# EAGLE design 208_humidity_hts221 (EAGLE 9.6.2)
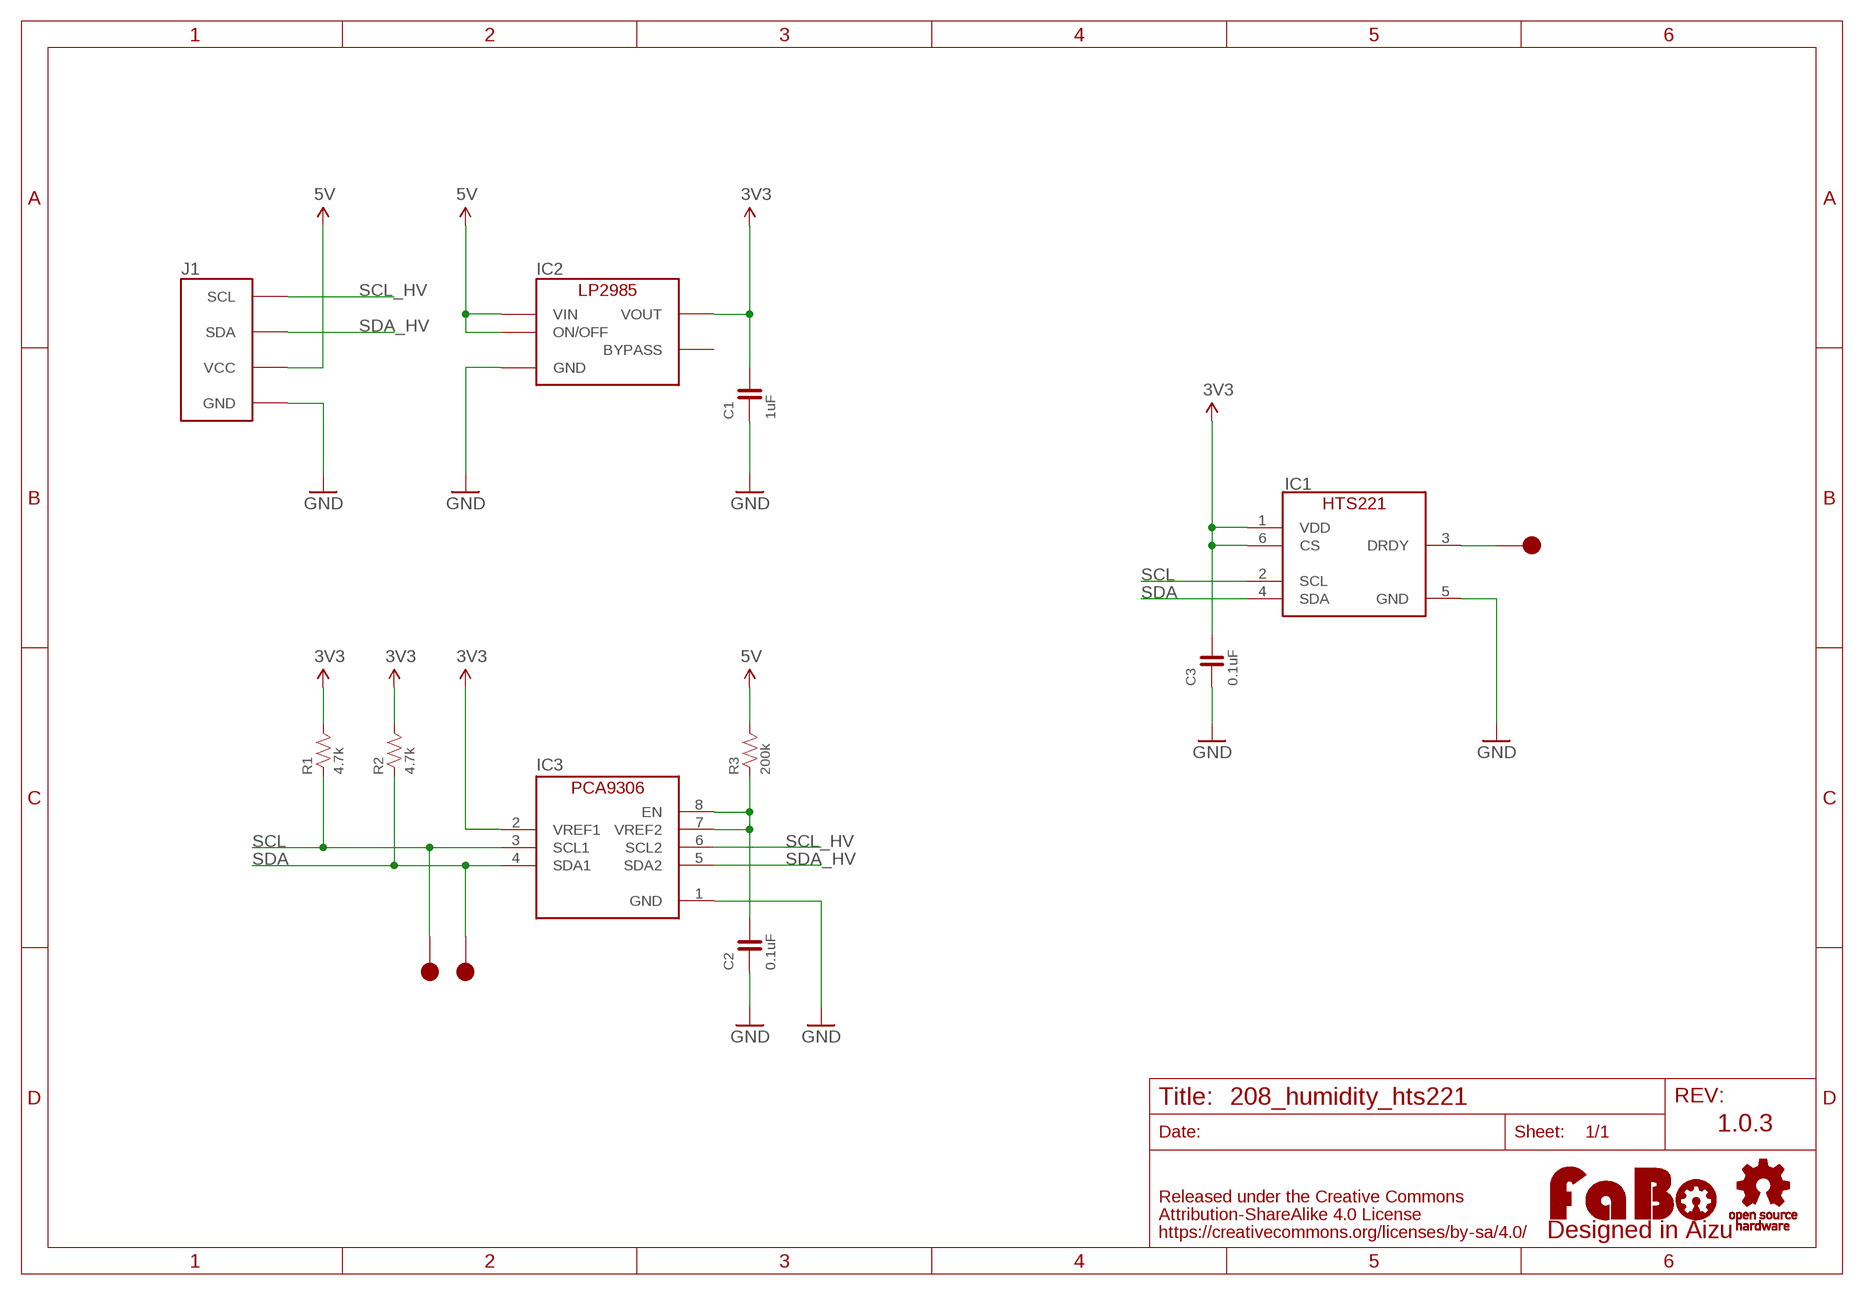
[diagram p0: schematic, sheet 1]

## Parts
C1  1uF  CAPACITOR-0603  [0603]
C2  0.1uF  CAPACITOR-0603  [0603]
C3  0.1uF  CAPACITOR-0603  [0603]
IC1  ST-HTS221  [ST-HTS221]
IC2  LP2985-33DBV  [SOT-23-5]
IC3  PCA9306GM  [XQFN8]
J1  FABO_BRICK_I2C  [FABO_BRICK_I2C]
LOGO1  LOGO_FABO-M  [LOGO_FABO_M]
R1  4.7k  RESISTOR-0603  [0603]
R2  4.7k  RESISTOR-0603  [0603]
R3  200k  RESISTOR-0603  [0603]
TP1  TP-15  [TP-15]
TP2  TP-15  [TP-15]
TP3  TP-15  [TP-15]
U$3  LOGO_OSHW-M_BOTTOM  [LOGO_OSHW_M_BOTTOM]

## Nets
3V3: C1.2 C3.2 IC1.1(VDD) IC1.6(CS) IC2.5(VOUT) IC3.2(VREF1) R1.2 R2.2
5V: IC2.1(VIN) IC2.3(ON/OFF) J1.VCC R3.2
GND: C1.1 C2.1 C3.1 IC1.5(GND) IC2.2(GND) IC3.1(GND) J1.GND
N$1: C2.2 IC3.7(VREF2) IC3.8(EN) R3.1
N$2: IC1.3(DRDY) TP3.1
SCL: IC1.2(SCL) IC3.3(SCL1) R1.1 TP2.1
SCL_HV: IC3.6(SCL2) J1.SCL
SDA: IC1.4(SDA) IC3.4(SDA1) R2.1 TP1.1
SDA_HV: IC3.5(SDA2) J1.SDA
Unconnected: IC2.4(BYPASS)

## Notes on the sheet
- 1.0.3

## Library data of the parts
C1-C3 = FaBo-Capacitor:CAPACITOR: CAPACITOR
IC1 = FaBo-Mems:ST-HTS221
IC2 = FaBo-Supply:LP2985: LP2985
IC3 = FaBo-LevelTranslator:PCA9306
J1 = FaBo-Template:FABO_BRICK_I2C: FaBo Brick I2C
LOGO1 = component:LOGO_FABO
R1-R3 = FaBo-Resistors:RESISTOR: RESISTOR
TP1-TP3 = FaBo-Supply:TP
U$3 = FaBo-etc:LOGO_OSHW

## Board
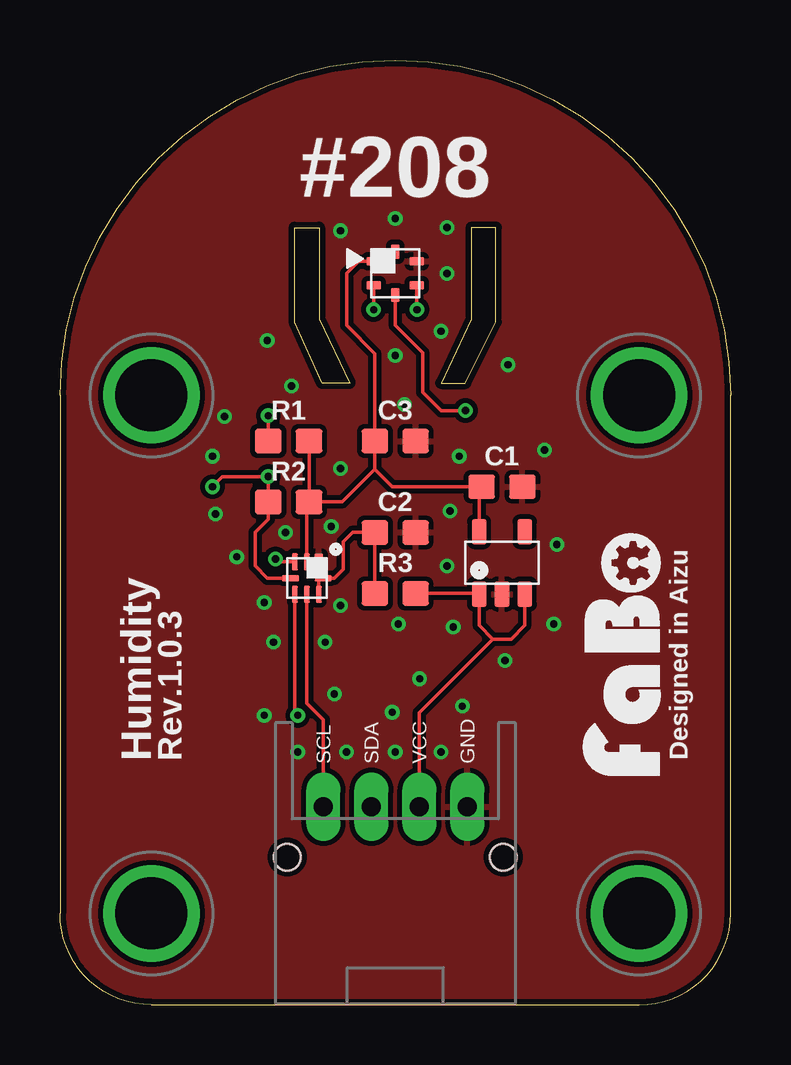
[diagram p1: board, top side]
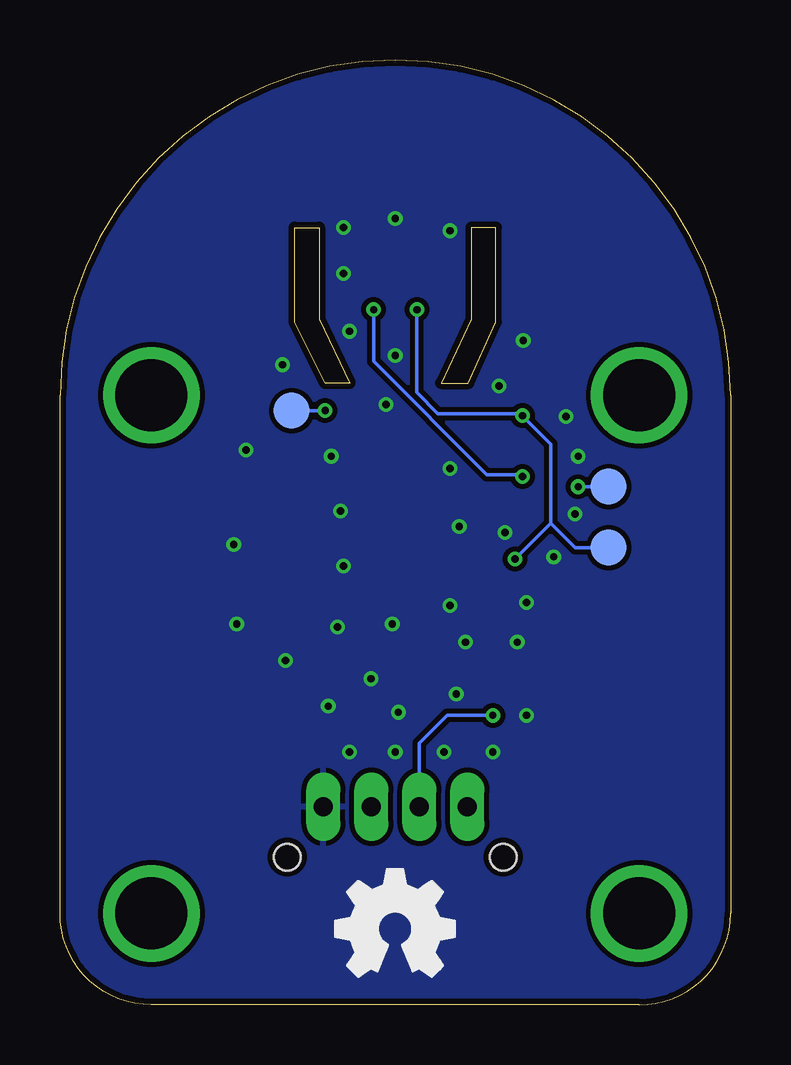
[diagram p2: board, bottom side, seen from below]

Size 27.94 x 39.37 mm. Coordinates in mm from the lower left corner, seen from the top.
Outline: 10.79,32.38 10.79,28.57 12.06,25.91 10.92,25.91 9.78,28.45 9.78,32.38 10.79,32.38
Outline: 17.14,32.38 17.14,28.57 15.88,25.91 16.89,25.91 18.16,28.45 18.16,32.38 17.14,32.38
Copper layers (1*16): Top 0.035mm / dielectric 1.6mm / Bottom 0.035mm
Design rules "PCBway": minimum track width 6mil, minimum drill 12mil, track to track 6mil, track to pad 6mil, pad to pad 6mil, via to via 6mil, smd to smd 6mil, copper to edge 10mil, drill to drill 10mil, minimum pad ring 10mil, minimum via ring 6mil, stop-mask expansion 2mil, vias tented up to drill 100mil, thermal gap 8mil

### Footprints (pad centres in the part's own frame; a part is rotated, then mirrored left to right if it is on the bottom)
0603 = smd 1.1 x 1: 1 -0.85,0; 2 0.85,0
ST-HTS221 = smd 0.6 x 0.35: 1 -0.9,0.5; 2 -0.9,-0.5; 4 0.9,-0.5; 5 0.9,0.5 | smd 0.35 x 0.6: 3 0,-0.9; 6 0,0.9
SOT-23-5 = smd 0.6 x 1.05: 1 -0.95,-1.3; 2 0,-1.3; 3 0.95,-1.3; 4 0.95,1.3; 5 -0.95,1.3
XQFN8 = smd 0.7 x 0.35: 1 -0.675,0.5 | smd 0.7 x 0.25: 2 -0.675,0; 3 -0.675,-0.5; 5 0.675,-0.5; 6 0.675,0; 7 0.675,0.5 | smd 0.25 x 0.7: 4 0,-0.675; 8 0,0.675
FABO_BRICK_I2C = drill 0.8 pad 1.422 long: GND 3,-10.795; SCL -3,-10.795; SDA -1,-10.795; VCC 1,-10.795 | drill 3 pad 3.81: P$1 -10.16,6.35; P$2 10.16,6.35; P$3 -10.16,-15.24; P$4 10.16,-15.24 | hole 1.1: -4.5,-12.895; 4.5,-12.895
TP-15 = smd 1.5 x 1.5: 1 0,0

### Placement (x,y rotation side)
C1  18.41,21.59 180 top
C2  13.97,19.68 180 top
C3  13.97,23.5 180 top
IC1  13.97,30.48 0 top
IC2  18.41,18.41 0 top
IC3  10.29,17.78 270 top
J1  13.97,19.05 0 top
LOGO1  25.4,14.61 90 top
R1  9.53,23.5 0 top
R2  9.53,20.95 0 top
R3  13.97,17.14 0 top
TP1  5.08,21.59 0 bottom
TP2  5.08,19.05 0 bottom
TP3  18.29,24.77 0 bottom
U$3  13.97,3.17 0 top

### Tracks (layer width: path | path; a pad name or v marks a point on that pad's centre or on a via)
3V3
  Top 0.152: IC1.6 13.57,30.98 IC1.1 12.44,30.98 11.94,30.48 11.94,28.32 13.12,27.14 C3.2 13.12,22.31 | 13.12,22.31 13.84,21.59 C1.2 17.46,21.49 IC2.5 | R2.2 11.76,20.95 13.12,22.31 | R2.2 R1.2 | IC3.2 10.29,20.87 R2.2
5V
  Top 0.152: 18.03,15.24 17.46,15.81 IC2.1 17.43,17.14 R3.2 | IC2.3 19.36,15.81 18.8,15.24 18.03,15.24 | J1.VCC 14.97,12.18 18.03,15.24
GND  (via drill 0.3)
  other vias: 13.97,27.05 15.88,28.07 16.13,30.48 16.13,32.38 13.97,32.77 11.68,32.26 14.35,25.02 11.68,22.35 11.3,19.94 9.4,19.68 6.48,20.45 7.37,18.67 16.26,20.57 16.13,18.29 16.38,15.75 11.68,16.64 8.51,16.76 8.51,12.06 11.43,12.95 9.91,10.54 11.94,10.54 13.97,10.54 15.88,10.54 16.76,12.45 14.99,13.59 13.84,12.19 11.05,15.11 8.89,15.11 20.57,15.88 20.7,19.18 16.64,22.86 9.65,25.78 6.86,24.51 6.35,22.86 8.64,27.69 18.67,26.67 20.19,23.11 14.1,15.88 18.54,14.35
  pour Bottom (isolate 0.203): 0,0 27.94,0 27.94,39.37 0,39.37
  pour Top (isolate 0.203): 0,0 27.94,0 27.94,39.37 0,39.37
N$1
  Top 0.152: IC3.7 10.79,17.78 IC3.8 11.43,17.78 11.81,18.16 11.81,19.3 12.19,19.68 C2.2 R3.1
N$2  (via drill 0.3)
  Top 0.152: IC1.3 13.97,28.32 15.11,27.18 15.11,25.53 15.88,24.77 v16.89,24.77
  Bottom 0.152: v16.89,24.77 TP3.1
SCL  (via drill 0.3)
  Top 0.152: IC1.2 v13.07,28.97 | R1.1 v8.68,24.55 | IC3.3 9.1,18.45 v8.98,18.58
  Bottom 0.152: v13.07,28.97 13.07,25.52 12.19,24.64 8.76,24.64 v8.68,24.55 7.49,23.37 7.49,20.07 | v8.98,18.58 7.49,20.07 | TP2.1 6.48,19.05 7.49,20.07
SCL_HV
  Top 0.152: IC3.6 10.29,12.57 10.97,11.89 J1.SCL
SDA  (via drill 0.3)
  Top 0.152: IC1.4 v14.87,28.97 | IC3.4 8.64,17.78 8.13,18.29 8.13,19.68 8.68,20.23 R2.1 v8.68,22.01 6.77,22.01 v6.35,21.59
  Bottom 0.152: v8.68,22.01 8.76,22.1 10.16,22.1 14.87,26.81 v14.87,28.97 | v6.35,21.59 TP1.1
SDA_HV  (via drill 0.3)
  Top 0.152: IC3.5 9.79,12.18 v9.91,12.06
  Bottom 0.152: v9.91,12.06 11.81,12.06 12.97,10.91 J1.SDA

### Text on the board
tPlace: #208 | Designed in Aizu | Humidity | Rev.1.0.3